# Altium schematic sheet HyperRAM.SchDoc: Pulp FMC Sensor Board
size A4; Author: A. Blanco Fontao; CompanyName: ETHZ; DrawnBy: A. Blanco Fontao; Organization: Microelectronics Design Center; Address1: Gloriastrasse 35; Address2: 8092 Zurich; Address3: Switzerland; SheetNumber: 4; SheetTotal: 7
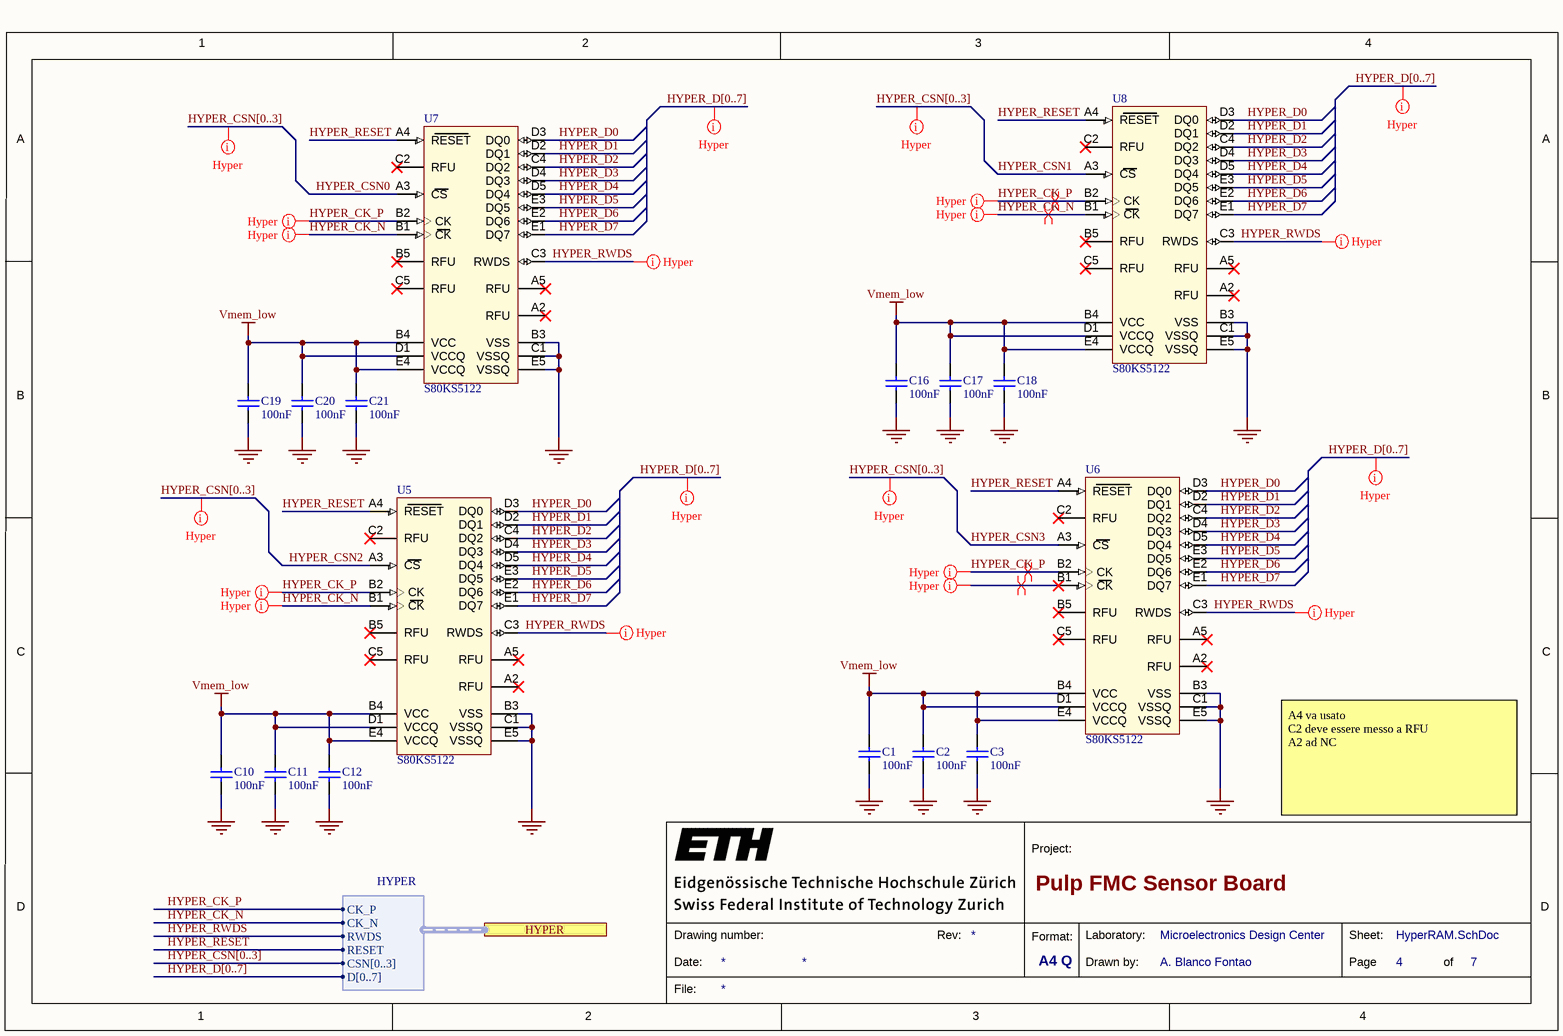
[diagram p0: HyperRAM.SchDoc]

## Parts
C1  value 100nF  [CAPC0603(1608)100_N]  (hidden comment: CAP 100nF 25V 0603(1608))
C2  value 100nF  [CAPC0603(1608)100_N]  (hidden comment: CAP 100nF 25V 0603(1608))
C3  value 100nF  [CAPC0603(1608)100_N]  (hidden comment: CAP 100nF 25V 0603(1608))
C10  value 100nF  [CAPC0603(1608)100_N]  (hidden comment: CAP 100nF 25V 0603(1608))
C11  value 100nF  [CAPC0603(1608)100_N]  (hidden comment: CAP 100nF 25V 0603(1608))
C12  value 100nF  [CAPC0603(1608)100_N]  (hidden comment: CAP 100nF 25V 0603(1608))
C16  value 100nF  [CAPC0603(1608)100_N]  (hidden comment: CAP 100nF 25V 0603(1608))
C17  value 100nF  [CAPC0603(1608)100_N]  (hidden comment: CAP 100nF 25V 0603(1608))
C18  value 100nF  [CAPC0603(1608)100_N]  (hidden comment: CAP 100nF 25V 0603(1608))
C19  value 100nF  [CAPC0603(1608)100_N]  (hidden comment: CAP 100nF 25V 0603(1608))
C20  value 100nF  [CAPC0603(1608)100_N]  (hidden comment: CAP 100nF 25V 0603(1608))
C21  value 100nF  [CAPC0603(1608)100_N]  (hidden comment: CAP 100nF 25V 0603(1608))
U5  S80KS5122  [FBGA24_A-130]
U6  S80KS5122  [FBGA24_A-130]
U7  S80KS5122  [FBGA24_A-130]
U8  S80KS5122  [FBGA24_A-130]

## Ports
HYPER (harness HYPER)

## Harnesses
HYPER: CK_N, CK_P, RWDS, CSN[0..3], D[0..7], RESET

## Nets
GND: C1.1 C2.1 C3.1 C10.1 C11.1 C12.1 C16.1 C17.1 C18.1 C19.1 C20.1 C21.1 U5.B3(VSS) U5.C1(VSSQ) U5.E5(VSSQ) U6.B3(VSS) U6.C1(VSSQ) U6.E5(VSSQ) U7.B3(VSS) U7.C1(VSSQ) U7.E5(VSSQ) U8.B3(VSS) U8.C1(VSSQ) U8.E5(VSSQ)
Vmem_low: C1.2 C2.2 C3.2 C10.2 C11.2 C12.2 C16.2 C17.2 C18.2 C19.2 C20.2 C21.2 U5.B4(VCC) U5.D1(VCCQ) U5.E4(VCCQ) U6.B4(VCC) U6.D1(VCCQ) U6.E4(VCCQ) U7.B4(VCC) U7.D1(VCCQ) U7.E4(VCCQ) U8.B4(VCC) U8.D1(VCCQ) U8.E4(VCCQ)
HYPER_CK_N: U5.B1(CK) U7.B1(CK) U8.B1(CK) ; port HYPER.CK_N
HYPER_CK_P: U5.B2(CK) U6.B2(CK) U7.B2(CK) U8.B2(CK) ; port HYPER.CK_P
HYPER_CSN0: U7.A3(CS)
HYPER_CSN1: U8.A3(CS)
HYPER_CSN2: U5.A3(CS)
HYPER_CSN3: U6.A3(CS)
HYPER_D0: U5.D3(DQ0) U6.D3(DQ0) U7.D3(DQ0) U8.D3(DQ0)
HYPER_D1: U5.D2(DQ1) U6.D2(DQ1) U7.D2(DQ1) U8.D2(DQ1)
HYPER_D2: U5.C4(DQ2) U6.C4(DQ2) U7.C4(DQ2) U8.C4(DQ2)
HYPER_D3: U5.D4(DQ3) U6.D4(DQ3) U7.D4(DQ3) U8.D4(DQ3)
HYPER_D4: U5.D5(DQ4) U6.D5(DQ4) U7.D5(DQ4) U8.D5(DQ4)
HYPER_D5: U5.E3(DQ5) U6.E3(DQ5) U7.E3(DQ5) U8.E3(DQ5)
HYPER_D6: U5.E2(DQ6) U6.E2(DQ6) U7.E2(DQ6) U8.E2(DQ6)
HYPER_D7: U5.E1(DQ7) U6.E1(DQ7) U7.E1(DQ7) U8.E1(DQ7)
HYPER_RESET: U5.A4(RESET) U6.A4(RESET) U7.A4(RESET) U8.A4(RESET) ; port HYPER.RESET
HYPER_RWDS: U5.C3(RWDS) U6.C3(RWDS) U7.C3(RWDS) U8.C3(RWDS) ; port HYPER.RWDS

Not connected (* = marked no-connect by the designer): U5 A2(RFU)* A5(RFU)* B5(RFU)* C2(RFU)* C5(RFU)*; U6 A2(RFU)* A5(RFU)* B1(CK)* B5(RFU)* C2(RFU)* C5(RFU)*; U7 A2(RFU)* A5(RFU)* B5(RFU)* C2(RFU)* C5(RFU)*; U8 A2(RFU)* A5(RFU)* B5(RFU)* C2(RFU)* C5(RFU)*

## Buses and harness runs
bus HYPER_CSN[0..3]
bus HYPER_D[0..7]

## Layout directives
net class Hyper: (no net found under the mark), HYPER_CK_N, HYPER_CK_P, HYPER_RWDS, NetU6_B1
differential pair: HYPER_CK_N, HYPER_CK_P, NetU6_B1

## Notes on the sheet
- A4 va usato
  C2 deve essere messo a RFU
  A2 ad NC
- 1
- 2
- 3
- 4
- A
- B
- C
- Project:
- D
- Date:
- Drawing number:
- Rev:
- Format:
- A4 Q
- Drawn by:
- Laboratory:
- Page
- Sheet:
- of
- File:

## Library data of the parts
C1-C3 C10-C12 C16-C21 = CMP-1035-02588-1: CAP 100nF 25V ±10% 0603 (1608 Metric) Thickness 1mm SMD; Case-Metric: 1608; Case-EIA: 0603; Tolerance: Â±10%; Max Thickness: 1 mm; Technology: SMT; Rated Voltage: 25 V
U5-U8 = S80KS5122: 512 Mb: HYPERRAM™ self-refresh dynamic / RAM (DRAM) with HYPERBUS™ interface / 1.8 V; ComponentLink1Description: New link; ComponentLink1URL: https://www.mouser.it/ProductDetail/Infineon-Technologies/S80KS5122GABHV020?qs=doiCPypUmgEJDMhxR%2Fbnog%3D%3D